# EAGLE design Enabled-Controller-Mini (EAGLE 9.6.2)
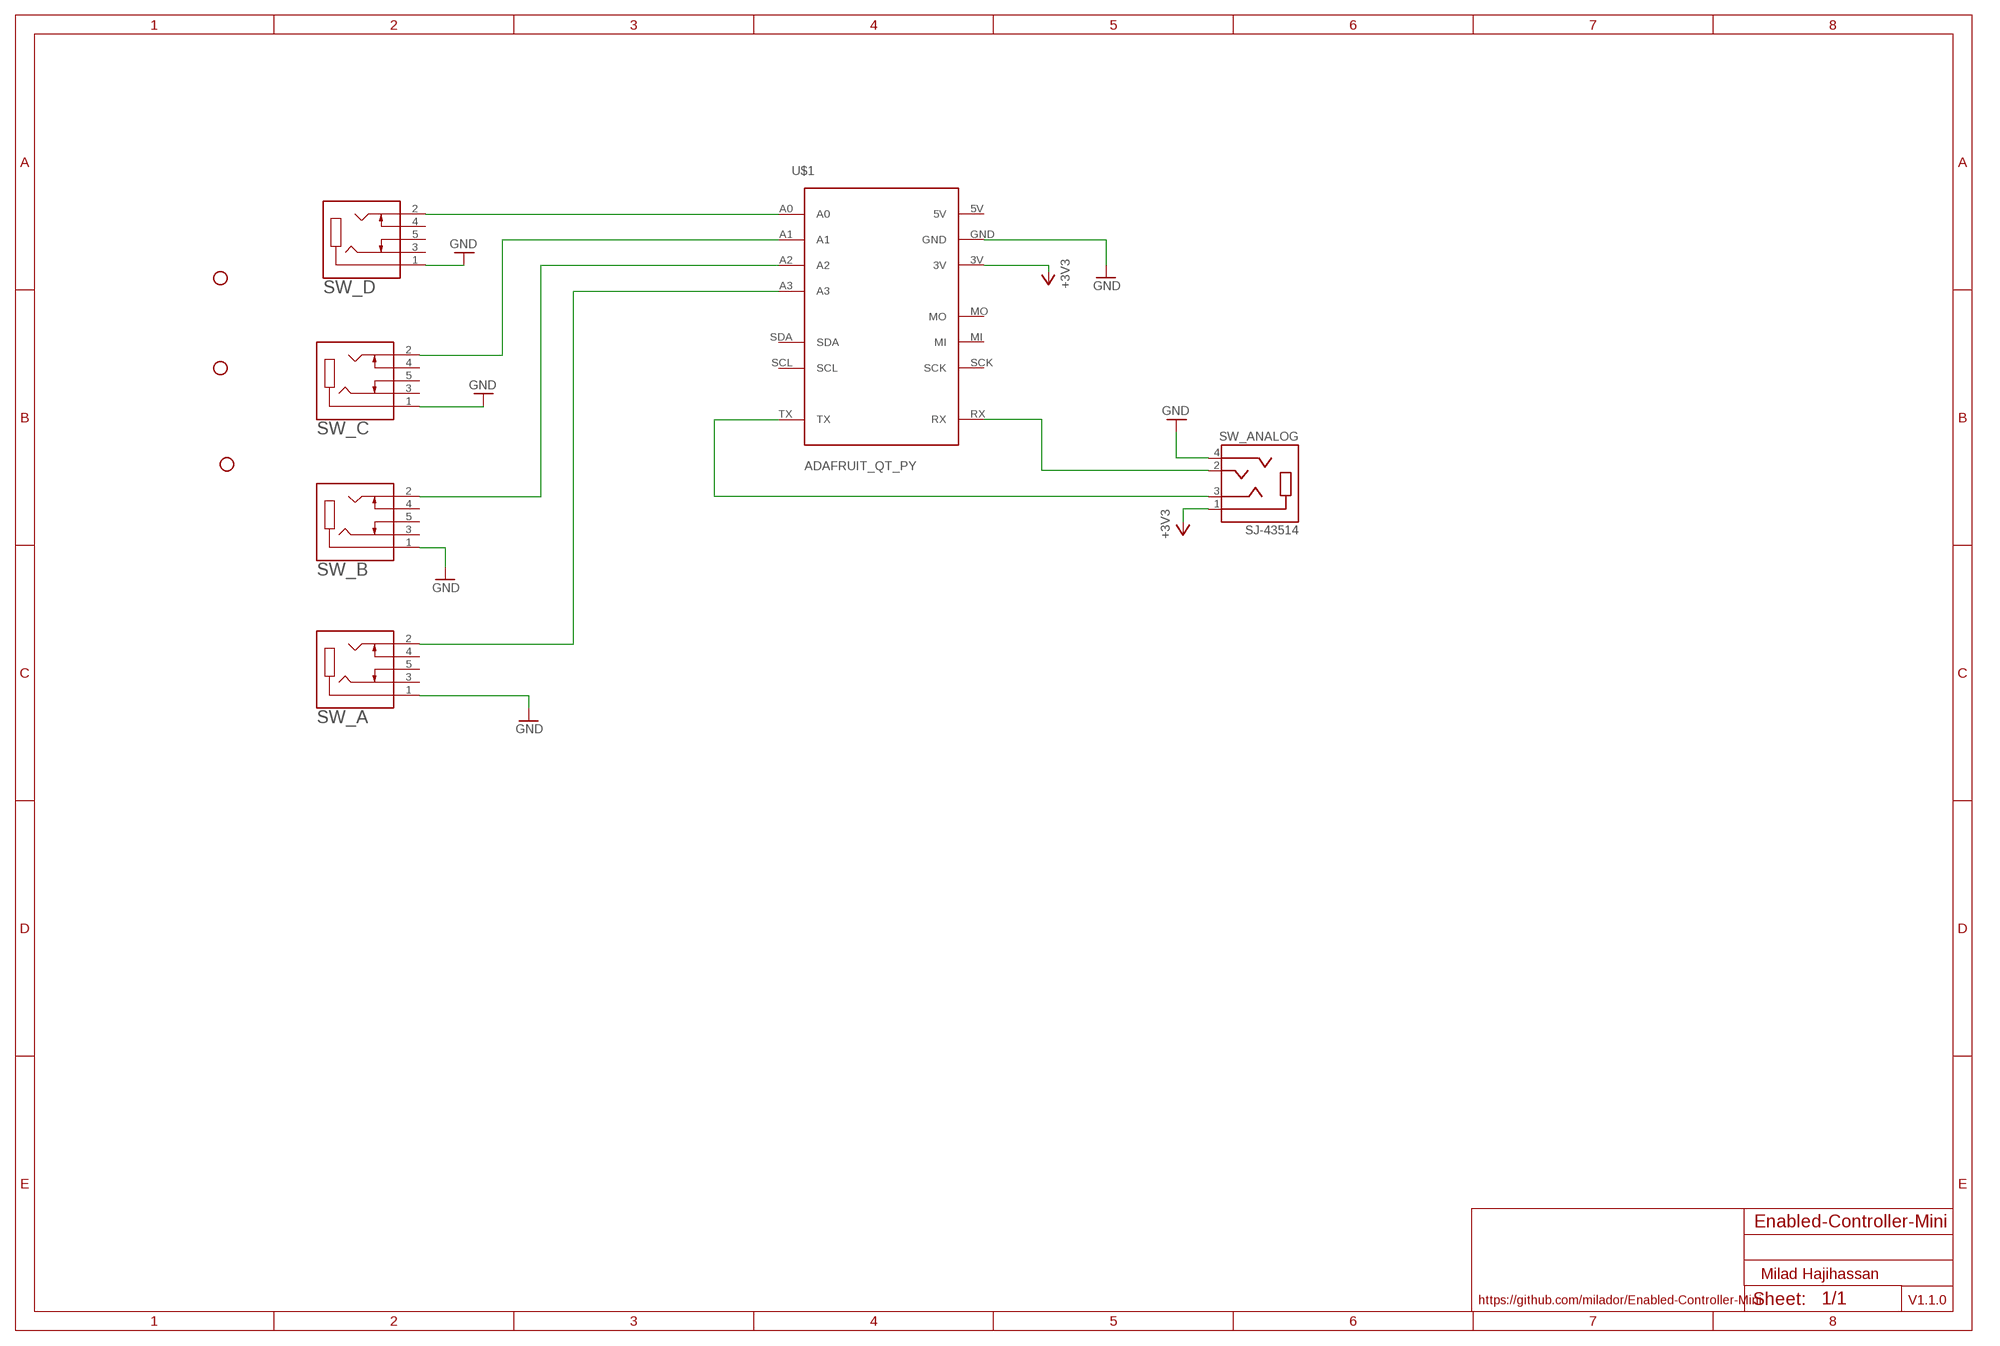
[diagram p0: schematic, sheet 1]

## Parts
STANDOFF1  STAND-OFF-  [STAND-OFF]
STANDOFF2  STAND-OFF-  [STAND-OFF]
STANDOFF3  STAND-OFF-  [STAND-OFF]
SW_A  CUI_SJ1-3535NGSJ1-3535NG  [CUI_SJ1-3535NG]
SW_ANALOG  SJ-43514  [CUI_SJ-43514]
SW_B  CUI_SJ1-3535NGSJ1-3535NG  [CUI_SJ1-3535NG]
SW_C  CUI_SJ1-3535NGSJ1-3535NG  [CUI_SJ1-3535NG]
SW_D  CUI_SJ1-3535NGSJ1-3535NG  [CUI_SJ1-3535NG]
U$1  ADAFRUIT_QT_PY  [QT_PY]

## Nets
+3V3: SW_ANALOG.1(SLEEVE) U$1.3V
GND: SW_A.1 SW_ANALOG.4(RING2) SW_B.1 SW_C.1 SW_D.1 U$1.GND
N$1: SW_B.2 U$1.A2
N$2: SW_A.2 U$1.A3
N$3: SW_D.2 U$1.A0
N$4: SW_ANALOG.2(TIP) U$1.RX
N$5: SW_C.2 U$1.A1
N$8: SW_ANALOG.3(RING1) U$1.TX
Unconnected: SW_A.3 SW_A.4 SW_A.5 SW_B.3 SW_B.4 SW_B.5 SW_C.3 SW_C.4 SW_C.5 SW_D.3 SW_D.4 SW_D.5 U$1.5V U$1.MI U$1.MO U$1.SCK U$1.SCL U$1.SDA

## Notes on the sheet
- Milad Hajihassan
- https://github.com/milador/Enabled-Controller-Mini | V1.1.0

## Library data of the parts
STANDOFF1-STANDOFF3 = MMC Eagle:STAND-OFF-
SW_A SW_B SW_C SW_D = MMC Eagle:CUI_SJ1-3535NG
SW_ANALOG = MMC Eagle:SJ-43514
U$1 = MMC Eagle:ADAFRUIT_QT_PY

## Net classes
0 GND: clearance 0.205 mm
2 GND2: clearance 0.205 mm to class 0, clearance 0.205 mm to class 1, clearance 0.205 mm
3 GND3: clearance 0.205 mm to class 0, clearance 0.205 mm to class 1, clearance 0.205 mm to class 2, clearance 0.205 mm

## Board
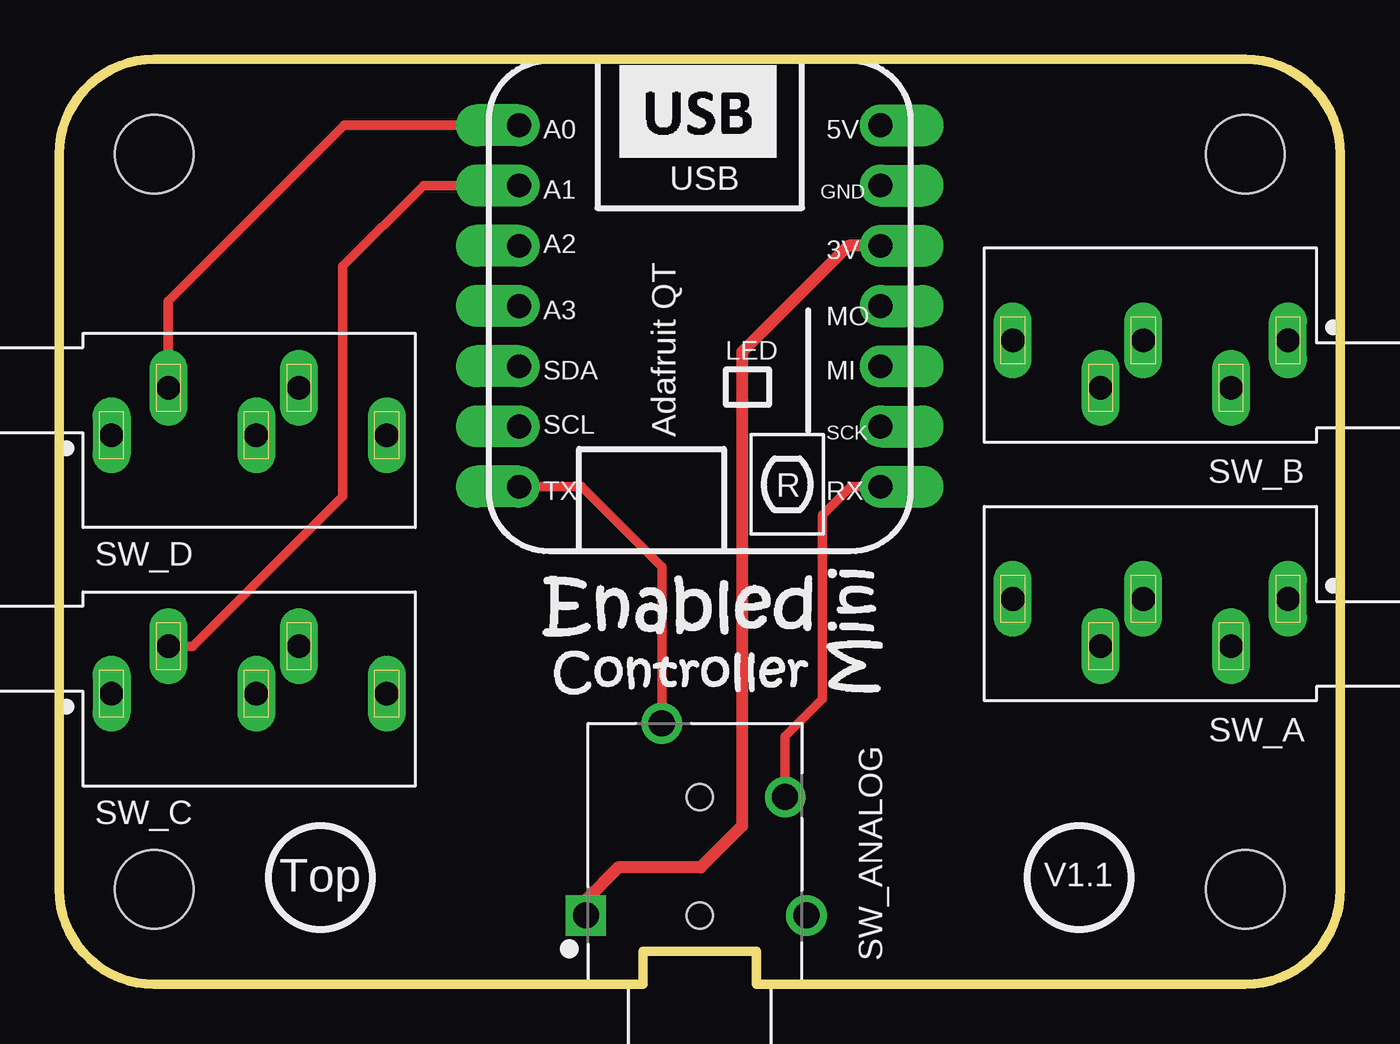
[diagram p1: board, top side]
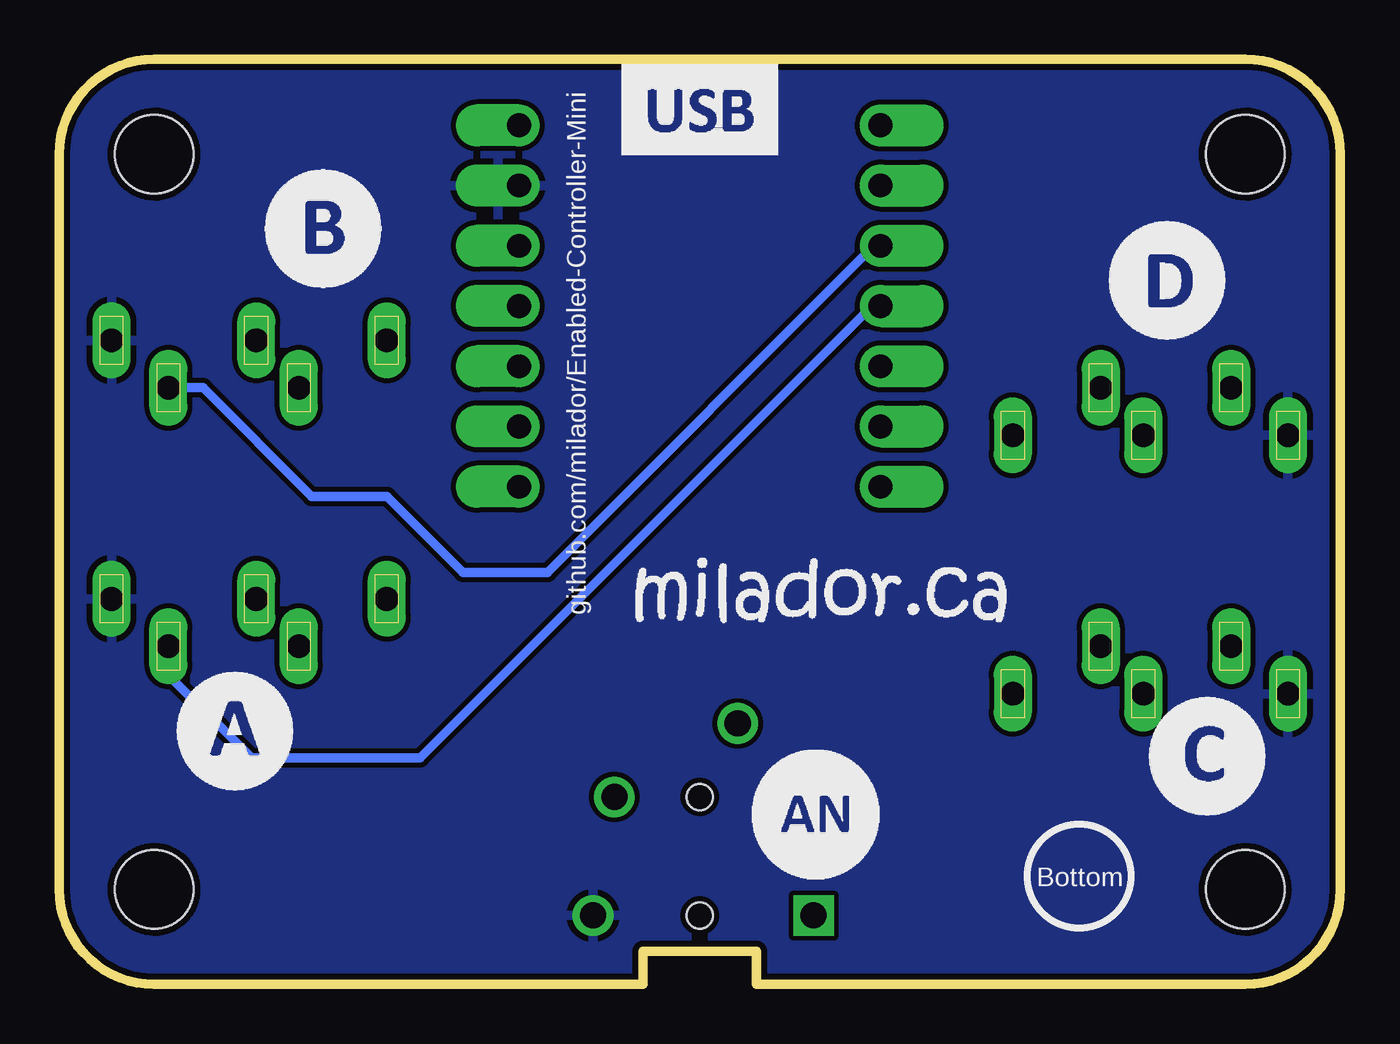
[diagram p2: board, bottom side, seen from below]

Size 54 x 39 mm. Coordinates in mm from the lower left corner, seen from the top.
Outline: 4,0 24.6,0 24.6,1.4 29.4,1.4 29.4,0 50,0 arc90 54,4 54,35 arc90 50,39 4,39 arc90 0,35 0,4 arc90 4,0
Copper layers (1*16): Top 0.035mm / dielectric 1.5mm / Bottom 0.035mm
Design rules "SparkFun": minimum track width 8mil, minimum drill 20mil, track to track 8mil, track to pad 8mil, pad to pad 8mil, via to via 8mil, smd to smd 8mil, copper to edge 10mil, drill to drill 8mil, minimum pad ring 12mil, minimum via ring 10mil, stop-mask expansion 4mil, vias tented up to drill 25mil, thermal gap 10mil

### Footprints (pad centres in the part's own frame; a part is rotated, then mirrored left to right if it is on the bottom)
STAND-OFF = hole 3.302: 0,0
CUI_SJ1-3535NG = drill 1 long: 1 0,0; 2 2.4,2; 3 7.9,2; 4 11.6,0; 5 6.1,0
CUI_SJ-43514 = drill 1.1 square: 1 -2.6,4.8 | drill 1.1: 2 2.4,-3.6; 3 5.5,1.6; 4 -2.6,-4.5 | hole 1.1: -2.6,0; 2.4,0
QT_PY = drill 1 pad 1.778 offset: 3V 16.51,12.887; 5V 16.51,17.967; A0 1.27,17.967; A1 1.27,15.427; A2 1.27,12.887; A3 1.27,10.347; GND 16.51,15.427; MI 16.51,7.807; MO 16.51,10.347; RX 16.51,2.727; SCK 16.51,5.267; SCL 1.27,5.267; SDA 1.27,7.807; TX 1.27,2.727

### Placement (x,y rotation side)
STANDOFF1  4,4 0 top
STANDOFF2  50,4 0 top
STANDOFF3  4,35 0 top
STANDOFF44  STAND-OFF-  [STAND-OFF]  50,35 0 top
SW_A  51.8,16.25 180 top
SW_ANALOG  27,5.5 90 top
SW_B  51.8,27.15 180 top
SW_C  2.2,12.25 0 top
SW_D  2.2,23.15 0 top
U$1  18.11,18.25 0 top

### Tracks (layer width: path | path; a pad name or v marks a point on that pad's centre or on a via)
+3V3
  Top 0.508: U$1.3V 33.27,31.14 28.79,26.66 28.79,6.67 27.03,4.92 23.55,4.92 22.2,3.57 SW_ANALOG.1
GND
  pour Bottom: 4,0 50,0 arc90 54,4 54,35 arc90 50,39 4,39 arc90 0,35 0,4 arc90
N$1
  Bottom 0.406: U$1.A2 19.65,31.14 33.42,17.37 36.98,17.37 40.19,20.57 43.35,20.57 47.93,25.15 SW_B.2
N$2
  Bottom 0.406: SW_A.2 49.4,13.04 45.9,9.54 38.8,9.54 19.74,28.6 U$1.A3
N$3
  Top 0.406: SW_D.2 4.6,28.8 12.01,36.22 U$1.A0
N$4
  Top 0.406: U$1.RX 33.37,20.98 32.18,19.79 32.18,12.03 30.6,10.46 SW_ANALOG.2
N$5
  Top 0.406: SW_C.2 5.63,14.25 11.95,20.57 11.95,30.28 15.35,33.68 U$1.A1
N$8
  Top 0.406: SW_ANALOG.3 25.4,17.59 22.02,20.98 U$1.TX

### Text on the board
tPlace: Top | V1.1
bPlace: github.com/milador/Enabled-Controller-Mini | Bottom